# Altium schematic sheet LastSchema.SchDoc
size A4; SheetNumber: 1; SheetTotal: 1
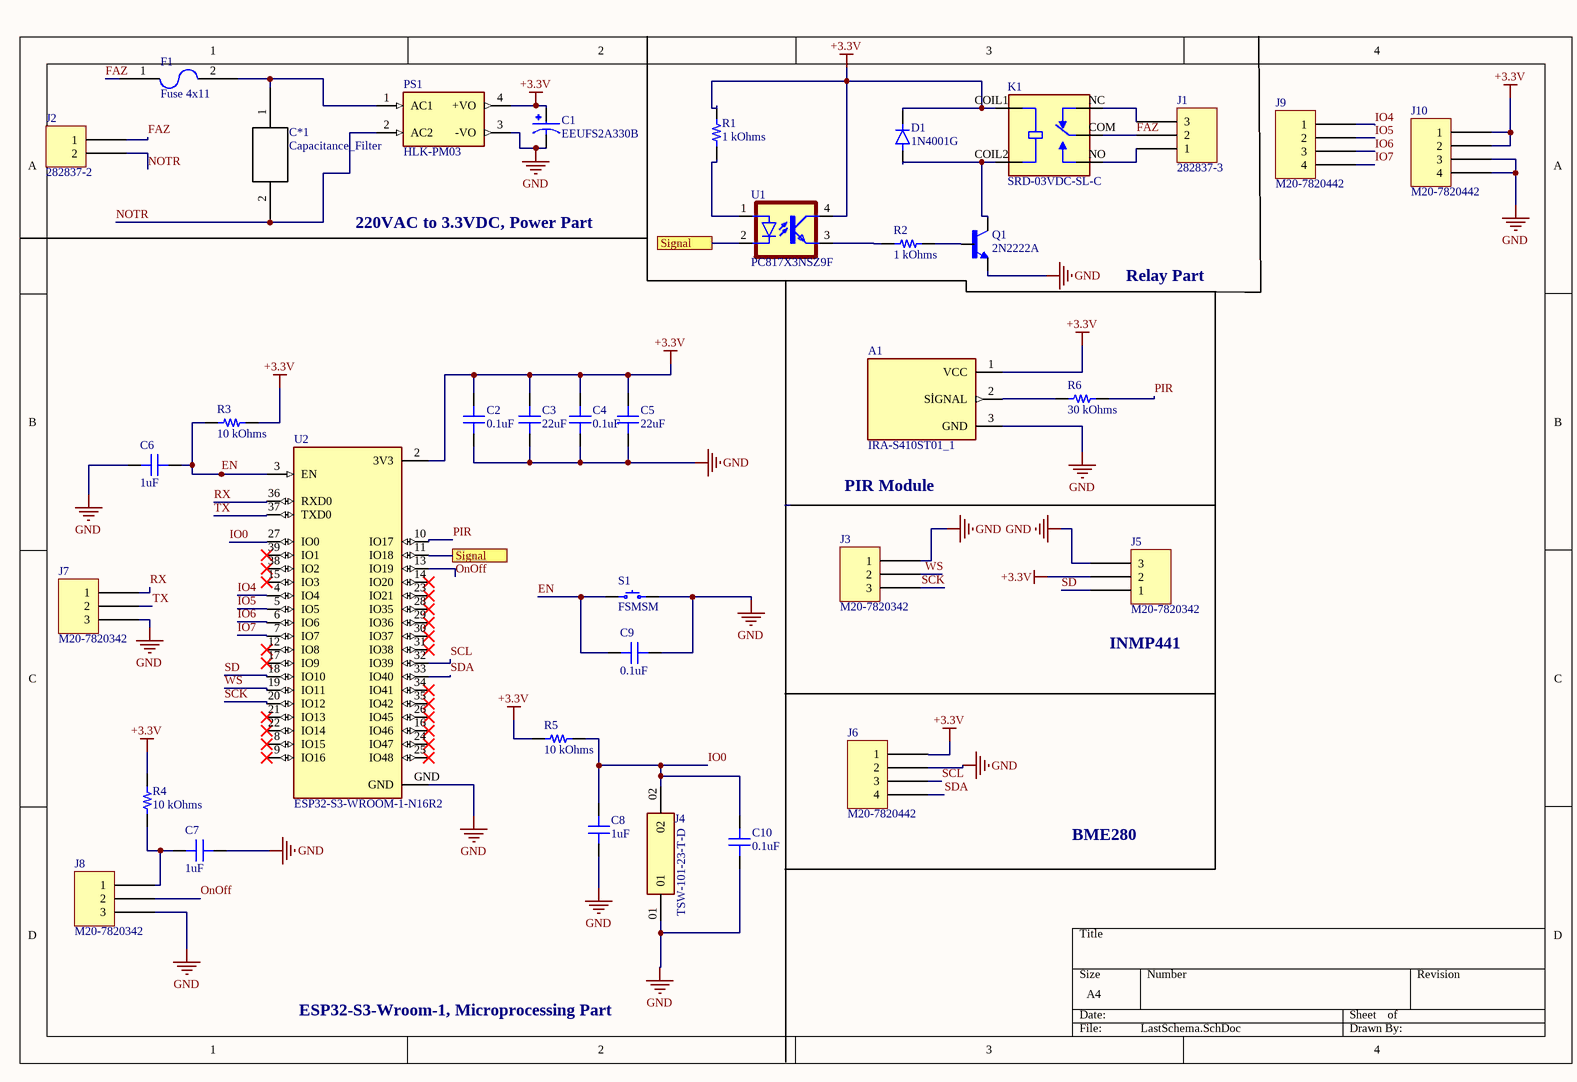
[diagram p0: LastSchema.SchDoc]

## Parts
A1  IRA-S410ST01_1  [TO254P940H490-3 - duplicate]
C1  EEUFS2A330B  [CAPPRD500W60D800H1150]
C2  Capacitance: 0.1uF  [CAP 0603_1608]  (hidden comment: 1 µF)
C3  Capacitance: 22uF  [CAP 0603_1608]  (hidden comment: 1 µF)
C4  Capacitance: 0.1uF  [CAP 0603_1608]  (hidden comment: 1 µF)
C5  Capacitance: 22uF  [CAP 0603_1608]  (hidden comment: 1 µF)
C6  Capacitance: 1uF  [CAP 0603_1608]  (hidden comment: 1 µF)
C7  Capacitance: 1uF  [CAP 0603_1608]  (hidden comment: 1 µF)
C8  Capacitance: 1uF  [CAP 0603_1608]  (hidden comment: 1 µF)
C9  Capacitance: 0.1uF  [CAP 0603_1608]  (hidden comment: 1 µF)
C10  Capacitance: 0.1uF  [CAP 0603_1608]  (hidden comment: 1 µF)
C*1  Capacitance_Filter  [Capacitance_Filter]
D1  1N4001G  [DIOAD1036W78L470D235]
F1  Fuse 4x11  [Fuse 4x11]
J1  282837-3  [TE 282837-3]
J2  282837-2  [TE 282837-2]
J3  M20-7820342  [HARWIN M20-7820345]
J4  TSW-101-23-T-D  [SAMTEC_TSW-101-23-T-D]
J5  M20-7820342  [HARWIN M20-7820345]
J6  M20-7820442  [HARWIN M20-7820445]
J7  M20-7820342  [HARWIN M20-7820345]
J8  M20-7820342  [HARWIN M20-7820345]
J9  M20-7820442  [HARWIN M20-7820445]
J10  M20-7820442  [HARWIN M20-7820445]
K1  SRD-03VDC-SL-C  [RELAY_SRD-03VDC-SL-C]
PS1  HLK-PM03  [CONV_HLK-PM03]
Q1  2N2222A  [TO92254P470H750-3]
R1  1 kOhms  [RES 0603_1608]
R2  1 kOhms  [RES 0603_1608]
R3  10 kOhms  [RES 0603_1608]
R4  10 kOhms  [RES 0603_1608]
R5  10 kOhms  [RES 0603_1608]
R6  30 kOhms  [RES 0603_1608]
S1  FSMSM  [TE FSMSMTR]
U1  PC817X3NSZ9F  [DIL04]
U2  ESP32-S3-WROOM-1-N16R2  [XCVR_ESP32-S3-WROOM-1-N16R2]

## Ports
Signal

## Nets
+3.3V: A1.1(VCC) C1.P C2.1 C3.1 C4.1 C5.1 D1.C(K) J5.2 J6.1 J10.1 J10.2 K1.COIL1 PS1.4(+VO) R1.2 R3.1 R4.1 R5.2 U1.4(COL) U2.2(3V3)
GND: A1.3(GND) C1.N C2.2 C3.2 C4.2 C5.2 C6.1 C7.2 C8.1 C9.1 C10.2 J3.1 J4.01 J5.3 J6.2 J7.3 J8.3 J10.3 J10.4 PS1.3(-VO) Q1.1(E) S1.2 U2.GND
EN: C6.2 C9.2 R3.2 S1.1 U2.3(EN)
FAZ: F1.1 J1.2 J2.1 K1.COM
IO0: C8.2 C10.1 J4.02 R5.1 U2.27(IO0)
IO4: J9.1 U2.4(IO4)
IO5: J9.2 U2.5(IO5)
IO6: J9.3 U2.6(IO6)
IO7: J9.4 U2.7(IO7)
NOTR: C*1.2 J2.2 PS1.2(AC2)
OnOff: J8.2 U2.13(IO19)
PIR: R6.2 U2.10(IO17)
RX: J7.1 U2.36(RXD0)
SCK: J3.3 U2.20(IO12)
SCL: J6.3 U2.32(IO39)
SD: J5.1 U2.18(IO10)
SDA: J6.4 U2.33(IO40)
Signal: U1.2(C) U2.11(IO18) ; port Signal
TX: J7.2 U2.37(TXD0)
WS: J3.2 U2.19(IO11)
NetA1_2: A1.2(SİGNAL) R6.1
NetC7_1: C7.1 J8.1 R4.2
NetC*1_1: C*1.1 F1.2 PS1.1(AC1)
NetD1_A: D1.A K1.COIL2 Q1.3(C)
NetJ1_1: J1.1 K1.NO
NetJ1_3: J1.3 K1.NC
NetQ1_2: Q1.2(B) R2.2
NetR1_1: R1.1 U1.1(A)
NetR2_1: R2.1 U1.3(EMIT)

Not connected (* = marked no-connect by the designer): U2 8(IO15)* 9(IO16)* 12(IO8)* 14(IO20)* 15(IO3)* 16(IO46)* 17(IO9)* 21(IO13)* 22(IO14)* 23(IO21)* 24(IO47)* 25(IO48)* 26(IO45)* 28(IO35)* 29(IO36)* 30(IO37)* 31(IO38)* 34(IO41)* 35(IO42)* 38(IO2)* 39(IO1)*

## Notes on the sheet
- 220VAC to 3.3VDC, Power Part
- Relay Part
- PIR Module
- (near J5) INMP441
- BME280
- ESP32-S3-Wroom-1, Microprocessing Part

## Library data of the parts
A1 = IRA-S410ST01_1: Sensor PIR (Passive Infrared) Motion Sensing Radial, Metal Can, Lensed - 3 Lead; MF: Murata; Arrow_Electronics-Purchase-URL: https://snapeda.com/shop?store=Arrow+Electronics&id=4970504; Availability: Bad; DigiKey-Purchase-URL: https://snapeda.com/shop?store=DigiKey&id=4970504; Package: Radial-3 Murata; Price: None; Mouser-Purchase-URL: https://snapeda.com/shop?store=Mouser&id=4970504; MP: IRA-S410ST01; SnapEDA_Link: https://www.snapeda.com/parts/IRA-S410ST01/Murata/view-part/4970504/?ref=snap; Value: *
C1 = EEUFS2A330B: CAP ALUM 33UF 20% 100V THRU HOLE; MF: Panasonic; Value: *; Check_prices: https://www.snapeda.com/parts/EEUFS2A330B/Panasonic/view-part/5795625/?ref=eda; Price: None; MP: EEUFS2A330B; SnapEDA_Link: https://www.snapeda.com/parts/EEUFS2A330B/Panasonic/view-part/5795625/?ref=snap; Availability: In Stock; Package: RADIAL-2 Panasonic
C2-C10 = C0603C105K4RACAUTO: CAP CER 1UF 16V X7R 0603; manufacturer: KEMET; Tolerance: ±10%; Part Number: C0603C105K4RACAUTO; Applications: Automotive, Bypass, Decoupling; componentlink1description: Datasheet; componentlink1url: https://api.kemet.com/component-edge/download/datasheet/C0603C105K4RACAUTO.pdf; componentlink2description: DigiKey Link; componentlink2url: https://www.digikey.com/en/products/detail/kemet/C0603C105K4RACAUTO/8635831; Device Package: 0603 (1608 Metric); lastupdated: 9.02.2024 20:10:30; Lifecycle Status: Active; Minimum Order: 1; Mounting Type: Surface Mount, MLCC; Operating Temperature: -55°C ~ 125°C; Package / Case: 0603 (1608 Metric); packaging: TapeAndReel; partid: 2179; Part Status: Active; price: 0.01; Ratings: AEC-Q200; series: SMD Auto X7R; Size / Dimension: 0.063" L x 0.031" W (1.60mm x 0.80mm); Supplier 1: DigiKey; Supplier Part Number 1: 399-17704-1-ND; Temperature Coefficient: X7R; Thickness (Max): 0.037" (0.95mm); value: 1 µF; Voltage - Rated: 16V
D1 = 1N4001G: 1A, 50V, Standard Recovery Rectifier; MF: Taiwan Semiconductor; Package: DO-41-2 Taiwan Semiconductor; Check_prices: https://www.snapeda.com/parts/1N4001G/Taiwan+Semiconductor/view-part/?ref=eda; Value: *; Price: None; MP: 1N4001G; Purchase-URL: https://pricing.snapeda.com/search/part/1N4001G/?ref=eda; SnapEDA_Link: https://www.snapeda.com/parts/1N4001G/Taiwan+Semiconductor/view-part/?ref=snap; Availability: In Stock
J1 = 282837-3: TERM BLK 3P SIDE ENT 5.08MM PCB; Manufacturer: TE Connectivity AMP Connectors; Current: 13.5 A; Mating Orientation: Horizontal with Board; Number of Levels: 1; Pitch: 0.200" (5.08mm); Positions Per Level: 3; Voltage: 300 V; Wire Gauge: 16-28 AWG; Wire Termination: Screw - Rising Cage Clamp; Part Number: 282837-3; Color: Green; ComponentLink1Description: Datasheet; ComponentLink1URL: https://www.te.com/commerce/DocumentDelivery/DDEController?Action=srchrtrv&DocNm=282837&DocType=Customer+Drawing&DocLang=English; ComponentLink2Description: DigiKey Link; ComponentLink2URL: https://www.digikey.com/en/products/detail/te-connectivity-amp-connectors/282837-3/2187974; Features: Interlocking (Side); LastUpdated: 21.06.2022 15:00:39; Lifecycle Status: Active; Minimum Order: 1; Mounting Type: Through Hole; Packaging: Tray; Part Status: Active; Price: 0.47; Series: Buchanan; Supplier 1: DigiKey; Supplier Part Number 1: A113321-ND
J2 = 282837-2: TERM BLK 2P SIDE ENT 5.08MM PCB; Manufacturer: TE Connectivity AMP Connectors; Current: 13.5 A; Mating Orientation: Horizontal with Board; Number of Levels: 1; Pitch: 0.200" (5.08mm); Positions Per Level: 2; Voltage: 300 V; Wire Gauge: 16-28 AWG; Wire Termination: Screw - Rising Cage Clamp; Part Number: 282837-2; Color: Green; ComponentLink1Description: Datasheet; ComponentLink1URL: https://www.te.com/commerce/DocumentDelivery/DDEController?Action=srchrtrv&DocNm=282837&DocType=Customer+Drawing&DocLang=English; ComponentLink2Description: DigiKey Link; ComponentLink2URL: https://www.digikey.com/en/products/detail/te-connectivity-amp-connectors/282837-2/2187973; Features: Interlocking (Side); LastUpdated: 21.06.2022 15:00:23; Lifecycle Status: Active; Minimum Order: 1; Mounting Type: Through Hole; Packaging: Tray; Part Status: Active; Price: 0.31; Series: Buchanan; Supplier 1: DigiKey; Supplier Part Number 1: A113320-ND
J3 J5 J7 J8 = M20-7820342: CONN RCPT 3POS 0.1 GOLD PCB; Manufacturer: Harwin Inc.; Connector Type: Receptacle; Contact Length - Post: 0.118" (3.00mm); Current Rating (Amps): 3A; Mated Stacking Heights: 11.04mm, 12.63mm; Material Flammability Rating: UL94 V-0; Number of Positions: 3; Number of Positions Loaded: All; Pitch - Mating: 0.100" (2.54mm); Style: Board to Board or Cable; Part Number: M20-7820342; ComponentLink1Description: Datasheet; ComponentLink1URL: https://cdn.harwin.com/pdfs/Harwin_PC_Connectors_M20.pdf; ComponentLink2Description: DigiKey Link; ComponentLink2URL: https://www.digikey.com/en/products/detail/harwin-inc/M20-7820342/3727752; Contact Finish - Mating: Gold; Contact Finish - Post: Tin; Contact Finish Thickness - Mating: Flash; Contact Type: Female Socket; Fastening Type: Push-Pull; Insulation Color: Black; Insulation Height: 0.335" (8.51mm); LastUpdated: 21.09.2022 18:55:13; Lifecycle Status: Active; Minimum Order: 1; Mounting Type: Through Hole; Number of Rows: 1; Operating Temperature: -40°C ~ 105°C; Packaging: Tube; Part Status: Active; Price: 0.42; Series: M20; Supplier 1: DigiKey; Supplier Part Number 1: 952-1783-ND; Termination: Solder
J4 = TSW-101-23-T-D: TSW Series .100 Terminal Strip; MF: Samtec; Package: None; MP: TSW-101-23-T-D; Price: None; Availability: Bad; Value: *; SnapEDA_Link: https://www.snapeda.com/parts/TSW-101-23-T-D/Samtec/view-part/3473100/?ref=snap
J6 J9 J10 = M20-7820442: CONN RCPT 4POS 0.1 GOLD PCB; Manufacturer: Harwin Inc.; Connector Type: Receptacle; Contact Length - Post: 0.118" (3.00mm); Current Rating (Amps): 3A; Mated Stacking Heights: 11.04mm, 12.63mm; Material Flammability Rating: UL94 V-0; Number of Positions: 4; Number of Positions Loaded: All; Pitch - Mating: 0.100" (2.54mm); Style: Board to Board or Cable; Part Number: M20-7820442; ComponentLink1Description: Datasheet; ComponentLink1URL: https://cdn.harwin.com/pdfs/Harwin_PC_Connectors_M20.pdf; ComponentLink2Description: DigiKey Link; ComponentLink2URL: https://www.digikey.com/en/products/detail/harwin-inc/M20-7820442/3727760; Contact Finish - Mating: Gold; Contact Finish - Post: Tin; Contact Finish Thickness - Mating: Flash; Contact Type: Female Socket; Fastening Type: Push-Pull; Insulation Color: Black; Insulation Height: 0.335" (8.51mm); LastUpdated: 21.09.2022 18:57:11; Lifecycle Status: Active; Minimum Order: 1; Mounting Type: Through Hole; Number of Rows: 1; Operating Temperature: -40°C ~ 105°C; Packaging: Tube; Part Status: Active; Price: 0.45; Series: M20; Supplier 1: DigiKey; Supplier Part Number 1: 952-1791-ND; Termination: Solder
K1 = SRD-03VDC-SL-C: Relays General Purpose Non Latching 3VDC SPDT 10A (250VAC) Max 5PIN; MF: Songle Relay; Value: *; Price: None; Package: Package; Availability: Not in stock; Check_prices: https://www.snapeda.com/parts/SRD-03VDC-SL-C/Songle+Relay/view-part/?ref=eda; MP: SRD-03VDC-SL-C; SnapEDA_Link: https://www.snapeda.com/parts/SRD-03VDC-SL-C/Songle+Relay/view-part/?ref=snap
PS1 = HLK-PM03: MF: Hi-link; Availability: Not in stock; SnapEDA_Link: https://www.snapeda.com/parts/HLK-PM03/Hi-link/view-part/?ref=snap; Price: None; MP: HLK-PM03; Package: Package; Check_prices: https://www.snapeda.com/parts/HLK-PM03/Hi-link/view-part/?ref=eda; Value: *
Q1 = 2N2222A: Bipolar (BJT) Transistor NPN 40 V 600 mA 250MHz 625 mW Through Hole TO-92; MF: Diotec Semiconductor; Package: TO-92-3 Diotec; Check_prices: https://www.snapeda.com/parts/2N2222A/Diotec/view-part/?ref=eda; Value: *; Purchase-URL: https://pricing.snapeda.com/search/part/2N2222A/?ref=eda; Availability: In Stock; SnapEDA_Link: https://www.snapeda.com/parts/2N2222A/Diotec/view-part/?ref=snap; MP: 2N2222A; Price: None
R1-R5 = ERJ-PB3D4642V: RES SMD 46.4K OHM 0.5% 1/5W 0603; Manufacturer: Panasonic Electronic Components; Power (Watts): 0.2W, 1/5W; Resistance: 46.4 kOhms; Temperature Coefficient: ±50ppm/°C; Part Number: ERJ-PB3D4642V; ComponentLink1Description: Datasheet; ComponentLink1URL: https://industrial.panasonic.com/cdbs/www-data/pdf/RDM0000/AOA0000C328.pdf; ComponentLink2Description: DigiKey Link; ComponentLink2URL: https://www.digikey.com/en/products/detail/panasonic-electronic-components/ERJ-PB3D4642V/6213255; Composition: Thick Film; Device Package: 0603 (1608 Metric); Features: Automotive AEC-Q200, Pulse Withstanding; Height - Seated (Max): 0.022" (0.55mm); LastUpdated: 9.02.2024 20:43:36; Lifecycle Status: Active; Minimum Order: 1; Number of Terminations: 2; Operating Temperature: -55°C ~ 155°C; Package / Case: 0603 (1608 Metric); Packaging: TapeAndReel; PartId: 5056; Part Status: Active; Price: 0.02; Ratings: AEC-Q200; Series: ERJ-PB3; Size / Dimension: 0.063" L x 0.031" W (1.60mm x 0.80mm); Supplier 1: DigiKey; Supplier Part Number 1: P20472CT-ND; Supplier Device Package: 0603; Tolerance: ±0.5%
  R1 R2: Value: 1 kOhms
  R3-R5: Value: 10 kOhms
R6 = RNCS0603BKE10K0: RES 10K OHM 0.1% 1/16W 0603; Manufacturer: Stackpole Electronics Inc; Power (Watts): 0.063W, 1/16W; Resistance: 10 kOhms; Temperature Coefficient: ±25ppm/°C; Part Number: RNCS0603BKE10K0; Value: 30 kOhms; ComponentLink1Description: Datasheet; ComponentLink1URL: https://www.seielect.com/catalog/sei-rncs_rnch.pdf; ComponentLink2Description: DigiKey Link; ComponentLink2URL: https://www.digikey.com/en/products/detail/stackpole-electronics-inc/RNCS0603BKE10K0/1708836; Composition: Thin Film; Device Package: 0603 (1608 Metric); Features: Anti-Corrosive, Automotive AEC-Q200, Moisture Resistant; Height - Seated (Max): 0.022" (0.55mm); LastUpdated: 9.02.2024 20:43:37; Lifecycle Status: Active; Minimum Order: 1; Number of Terminations: 2; Operating Temperature: -55°C ~ 155°C; Package / Case: 0603 (1608 Metric); Packaging: TapeAndReel; PartId: 4838; Part Status: Active; Price: 0.06; Ratings: AEC-Q200; Series: RNCS; Size / Dimension: 0.061" L x 0.031" W (1.55mm x 0.80mm); Supplier 1: DigiKey; Supplier Part Number 1: RNCS0603BKE10K0CT-ND; Supplier Device Package: 0603; Tolerance: ±0.1%
S1 = FSMSM: SWITCH TACTILE SPST-NO 0.05A 24V; Manufacturer: TE Connectivity ALCOSWITCH Switches; Actuator Height off PCB, Vertical: 4.57mm; Actuator Orientation: Top Actuated; Actuator Type: Standard; Contact Rating @ Voltage: 0.05A @ 24VDC; Illumination: Non-Illuminated; Operating Force: 180gf; Outline: 6.00mm x 3.50mm; Switch Function: Off-Mom; Part Number: FSMSM; Circuit: SPST-NO; ComponentLink1Description: Datasheet; ComponentLink1URL: https://www.te.com/commerce/DocumentDelivery/DDEController?Action=srchrtrv&DocNm=1437566-3&DocType=Customer+Drawing&DocLang=English; ComponentLink2Description: DigiKey Link; ComponentLink2URL: https://www.digikey.com/en/products/detail/te-connectivity-alcoswitch-switches/FSMSM/525812; LastUpdated: 3.06.2024 20:19:35; Lifecycle Status: Active; Minimum Order: 1; Mounting Type: Surface Mount; Operating Temperature: -35°C ~ 85°C; Packaging: Bulk; Part Status: Active; Price: 0.17; Series: FSMSM; Supplier 1: DigiKey; Supplier Part Number 1: 450-1140-ND; Termination Style: Gull Wing
U1 = PC817X3NSZ9F: Optoisolator Transistor Output 5000Vrms 1 Channel 4-DIP; MF: Sharp Microelectronics; SnapEDA_Link: https://www.snapeda.com/parts/PC817X3NSZ9F/Sharp+Microelectronics/view-part/?ref=snap; Package: DIP-4 Sharp Microelectronics; Value: *; MP: PC817X3NSZ9F; Check_prices: https://www.snapeda.com/parts/PC817X3NSZ9F/Sharp+Microelectronics/view-part/?ref=eda
U2 = ESP32-S3-WROOM-1-N16R2: Bluetooth, WiFi 802.11b/g/n, Bluetooth v5.0 Transceiver Module 2.4GHz PCB Trace Surface Mount; MF: Espressif Systems; MP: ESP32S3WROOM1N16R2; SnapEDA_Link: https://www.snapeda.com/parts/ESP32S3WROOM1N16R2/Espressif+Systems/view-part/?ref=snap; Package: NON STANDARD Espressif Systems; Value: *; Check_prices: https://www.snapeda.com/parts/ESP32S3WROOM1N16R2/Espressif+Systems/view-part/?ref=eda